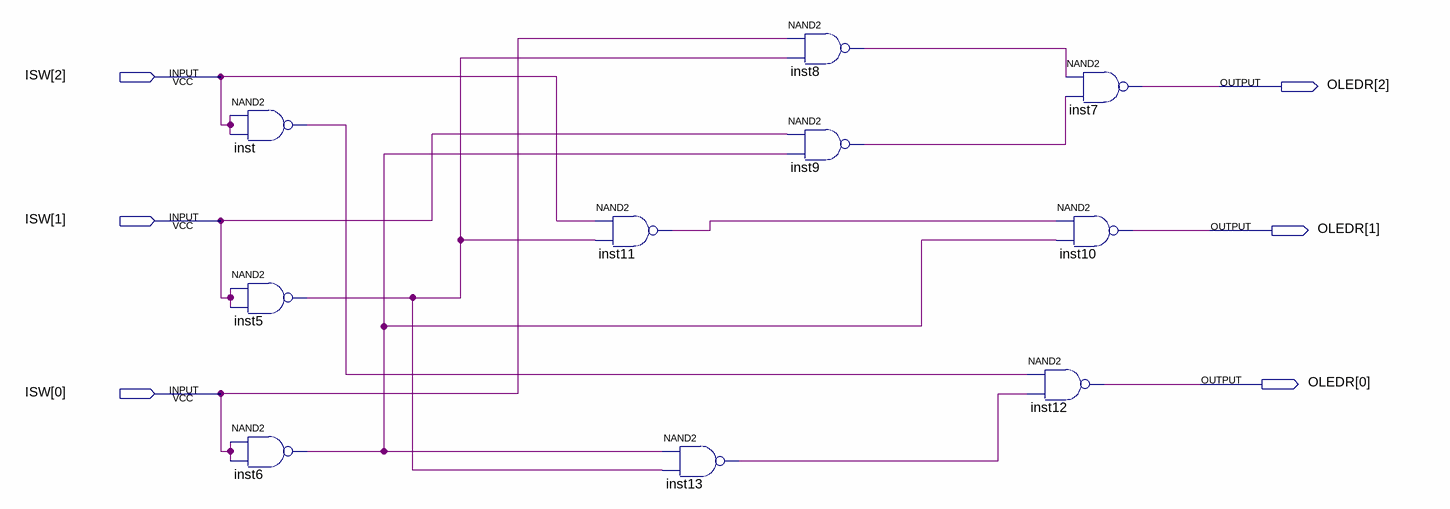
[diagram p0: schematic sheet]
// Quartus schematic Lab1-optimal.bdf as structural Verilog: 10 symbols, 6 pins
module \Lab1-optimal  (
  input  [2:0] ISW,
  output [2:0] OLEDR
);

  wire inst5_out, inst6_out, inst8_out, inst9_out, inst11_out, inst13_out, inst_out;

  nand inst (inst_out, ISW[2], ISW[2]);
  nand inst5 (inst5_out, ISW[1], ISW[1]);
  nand inst6 (inst6_out, ISW[0], ISW[0]);
  nand inst11 (inst11_out, ISW[2], inst5_out);
  nand inst13 (inst13_out, inst6_out, inst5_out);
  nand inst8 (inst8_out, ISW[0], inst5_out);
  nand inst9 (inst9_out, ISW[1], inst6_out);
  nand inst7 (OLEDR[2], inst8_out, inst9_out);
  nand inst10 (OLEDR[1], inst11_out, inst6_out);
  nand inst12 (OLEDR[0], inst_out, inst13_out);
endmodule
